# EAGLE design just_a_switch-mk-2-wrath-of-the-bjt (EAGLE 6.5.0)
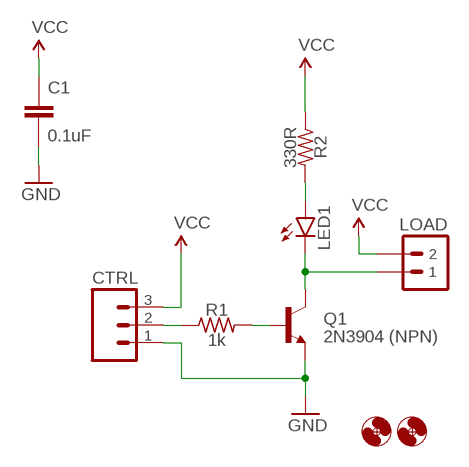
[diagram p0: schematic, sheet 1]

## Parts
C1  0.1uF  CAPACITOR-CERAMIC025-024X044  [C025-024X044]
CTRL  M03JST-PTH  [JST-3-PH-RA-PTH]
H1  HOLE#2  [HOLE-#2]
H2  HOLE#2  [HOLE-#2]
LED1  LED3MM  [LED3MM]
LOAD  M02JST-PTH-RA-SMALLPADS  [JST-2-PH-RA-PTH-SMALLPADS]
Q1  2N3904 (NPN)  TRANSISTOR_NPNTO-92-AMMO-EBC  [TO-92-AMMO]
R1  1k  RESISTORPTH-AXIAL-6.35MM  [RESISTOR-AXIAL-PTH-6.35MM]
R2  330R  RESISTORPTH-AXIAL-6.35MM  [RESISTOR-AXIAL-PTH-6.35MM]

## Nets
GND: C1.2 CTRL.1 Q1.1(E)
LOAD: LED1.K(C) LOAD.1 Q1.3(C)
N$1: CTRL.2 R1.P$1
N$2: LED1.A R2.P$2
N$3: Q1.2(B) R1.P$2
VCC: C1.1 CTRL.3 LOAD.2 R2.P$1

## Library data of the parts
C1 = A_butts:CAPACITOR-CERAMIC: CAPACITOR, European symbol
CTRL = A_butts:M03: Header 3 Standard 3-pin 0.1" header. Use with straight break away headers (SKU : PRT-00116), right angle break away headers (PRT-00553), swiss pins (PRT-00743), machine pins (PRT-00117), and female headers (PRT-00115). Molex polarized connector foot print use with SKU : PRT-08232 with associated crimp pins and housings.; SKU: PRT-09915
H1 H2 = A_butts:HOLE: MOUNTING HOLE with drill center marker
LED1 = A_butts:LED: LEDs Standard schematic elements and footprints for 5mm, 3mm, 1206, and 0603 sized LEDs. 5mm - Spark Fun Electronics SKU : COM-00529 (and others)
LOAD = A_butts:M02: Standard 2-pin 0.1" header. Use with - straight break away headers ( PRT-00116) - right angle break away headers (PRT-00553) - swiss pins (PRT-00743) - machine pins (PRT-00117) - female headers (PRT-00115) Molex polarized connector foot print use with: PRT-08233 with associated crimp pins and housings. 2.54_SCREWTERM for use with PRT-10571. 3.5mm Screw Terminal footprints for PRT-08084 5mm Screw Terminal footprints for use with PRT-08433
Q1 = A_butts:TRANSISTOR_NPN: Generic NPN BJT MMBT2222A - TRANS-08049 (SOT-23, 1A 40V) MPSA42 - TRANS-09116 (SOT-23, 500mA 300V) MMBT5088LT1G - TRANS-11160 (SOT-23, 50 mA 30V) BC547 - COM-08928 <http://www.sparkfun.com/products/8928> (TO-92 45V 100mA) (1.Collector 2.Base 3.Emitter) 2N3904 - COM-00521 <http://www.sparkfun.com/products/521> (TO-92 40V 200mA) (1.Emitter 2.Base 3.Collector) P2N2222A - COM-12852 <http://www.sparkfun.com/products/12852> (TO-92 40V 600mA) (1.Collector 2.Base 3.Emitter)
R1 R2 = A_butts:RESISTOR: RESISTOR, American symbol

## Board
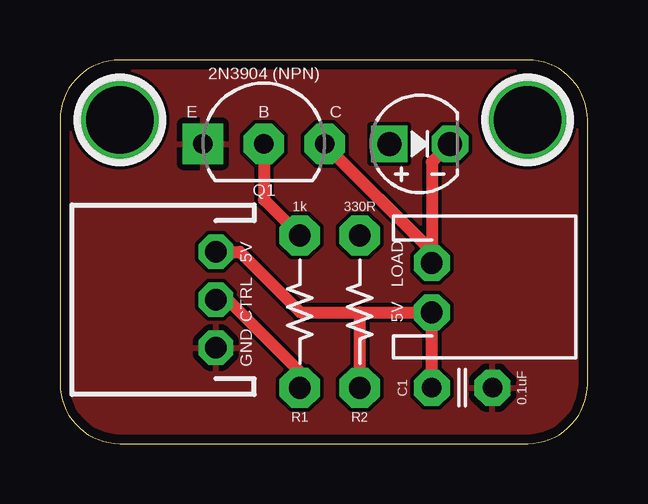
[diagram p1: board, top side]
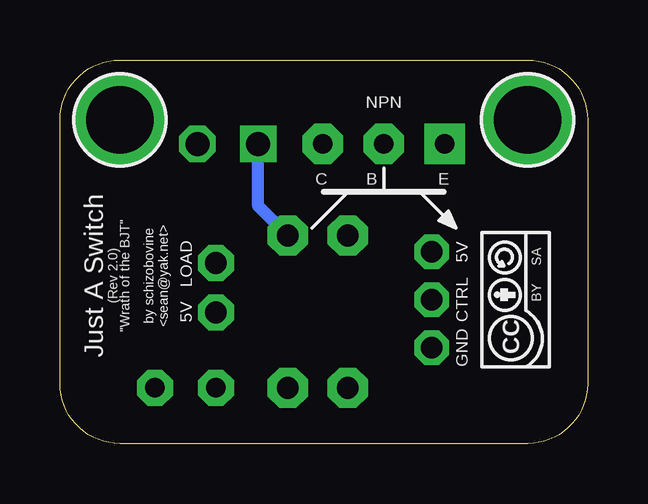
[diagram p2: board, bottom side, seen from below]

Size 22 x 16 mm. Coordinates in mm from the lower left corner, seen from the top.
Outline: 0,13.5 0,2.5 arc90 2.5,0 19.5,0 arc90 22,2.5 22,13.5 arc90 19.5,16 2.5,16 arc90 0,13.5
Copper layers (1*16): Top 0.0356mm / dielectric 1.5011mm / Bottom 0.0356mm
Design rules "LaenPCBOrder_2": minimum track width 6mil, minimum drill 13mil, track to track 6mil, track to pad 6mil, pad to pad 6mil, via to via 6mil, smd to smd 6mil, copper to edge 15mil, drill to drill 6mil, minimum pad ring 7mil, minimum via ring 7mil, stop-mask expansion 3mil, vias tented up to drill 20mil, thermal gap 10mil

### Footprints (pad centres in the part's own frame; a part is rotated, then mirrored left to right if it is on the bottom)
C025-024X044 = drill 0.813 pad 1.5 octagon: 1 -1.27,0; 2 1.27,0
JST-3-PH-RA-PTH = drill 0.9 pad 1.422 octagon: 1 -2,0; 2 0,0; 3 2,0
HOLE-#2 = drill 2.8 pad 3.81: P$1 0,0
LED3MM = drill 1 pad 1.524 square: A -1.27,0 | drill 1 pad 1.524 octagon: K 1.27,0
JST-2-PH-RA-PTH-SMALLPADS = drill 0.9 pad 1.5 octagon: 1 -1.03,0; 2 1.03,0
TO-92-AMMO = drill 0.813 pad 1.676 square: 1 -2.54,0 | drill 0.813 pad 1.676 octagon: 2 0,0; 3 2.54,0
RESISTOR-AXIAL-PTH-6.35MM = drill 0.9 pad 1.676 octagon: P$1 -3.175,0; P$2 3.175,0

### Placement (x,y rotation side)
C1  16.77,2.33 0 top
CTRL  6.5,6 90 top
H1  2.5,13.5 180 top
H2  19.5,13.5 180 top
LED1  15,12.5 0 top
LOAD  15.5,6.5 270 top
Q1  8.5,12.5 0 top
R1  10,5.5 90 top
R2  12.5,5.5 90 top
U$1  [CC-BY-SA-4.0-NO-URL]  3,6 90 bottom

### Tracks (layer width: path | path; a pad name or v marks a point on that pad's centre or on a via)
GND
  pour Top: 19.5,0 2.5,0 arc-90 0,2.5 0,13.5 arc-90 2.5,16 19.5,16 arc-90 22,13.5 22,2.5 arc-90
LOAD
  Top 0.5: LED1.K 15.5,11.73 LOAD.1 15.5,8.04 Q1.3
N$1
  Top 0.5: CTRL.2 7,6 10,3 R1.P$1
N$2
  Bottom 0.5: R2.P$2 13.73,9.9 LED1.A
N$3
  Top 0.5: Q1.2 8.5,10.18 R1.P$2
VCC
  Top 0.5: C1.1 LOAD.2 12.5,5.47 | CTRL.3 7.5,8 10.03,5.47 12.5,5.47 | R2.P$1 12.5,5.47

### Text on the board
tPlace: E | B | C
bPlace: NPN | E | B | C | by schizobovine / <sean@yak.net> | "Wrath of the BJT" | (Rev 2.0) | Just A Switch
tNames: 5V | LOAD | CTRL | 5V | GND
bNames: 5V | LOAD | CTRL | 5V | GND